# Altium schematic sheet DoorSensor.SchDoc
size A4
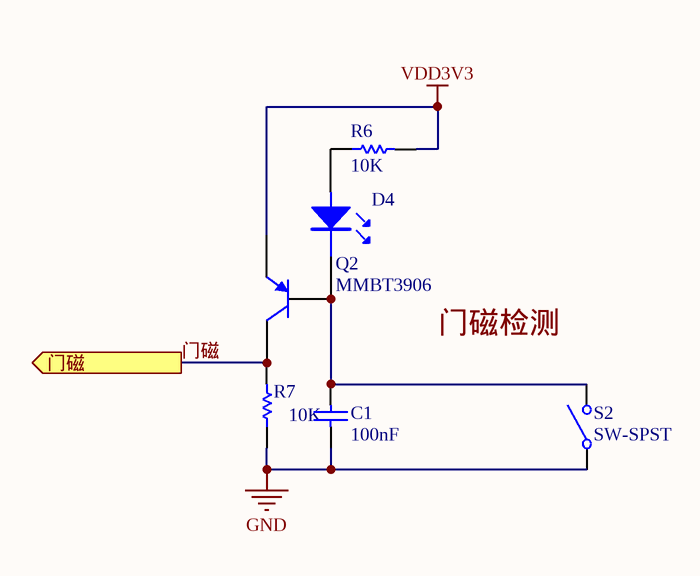
[diagram p0: DoorSensor.SchDoc]

## Parts
C1  value 100nF  [CAPC0805(2012)100_L]  (hidden comment: CAP 100nF 50V 0805(2012))
D4  (no value)  [0805-L]
Q2  MMBT3906  [SOT23_N]
R6  value 10K  [RESC0805(2012)_M]  (hidden comment: 10K 1% 0805(2012))
R7  value 10K  [RESC0805(2012)_M]  (hidden comment: 10K 1% 0805(2012))
S2  SW-SPST  [SPST-2]

## Ports
门磁 (out)

## Nets
GND: C1.1 R7.1 S2.1(COMMON)
VDD3V3: Q2.2(E) R6.2
门磁: Q2.3(C) R7.2 ; port 门磁
NetC1_2: C1.2 D4.2 Q2.1(B) S2.2(NO)
NetD4_1: D4.1 R6.1

## Notes on the sheet
- 门磁检测

## Library data of the parts
C1 = CMP-1036-04418-1: CAP 100nF 50V ±5% 0805 (2012 Metric) Thickness 1mm SMD; Case-EIA: 0805; Case-Metric: 2012; Tolerance: ±5%; Max Thickness: 1 mm; Technology: SMT; Rated Voltage: 50 V
D4 = LED
Q2 = MMBT3906: PNP Switching Transistor; Published: 17-Sep-2003; LatestRevisionDate: 12-Dec-2006; LatestRevisionNote: IPC-7351 Footprint Added.; DatasheetVersion: 11-Apr-2000; PackageVersion: May-1999; PackageReference: SOT23; Publisher: Altium Limited; PackageDescription: 3-Pin SOT-23 Package 0.95 mm Pitch, 2.3 mm Lead Span; ComponentLink1Description: Manufacturer Link; ComponentLink1URL: http://www.semiconductors.philips.com/; ComponentLink2Description: Datasheet; ComponentLink2URL: http://www.semiconductors.philips.com/acrobat/datasheets/MMBT3906_2.pdf
R6 R7 = CMP-1013-00623-1: 10K 0.125W 1% 0805 (2012 Metric)  SMD; Case-Metric: 2012; Case-EIA: 0805; Tolerance: 1 %; Power: 0.125 W; Technology: SMT
S2 = SW-SPST: Single-Pole, Single-Throw Switch; Published: 24-Mar-1999; LatestRevisionDate: 17-Jul-2002; LatestRevisionNote: Re-released for DXP Platform.; PackageReference: SPST-2; Publisher: Altium Limited